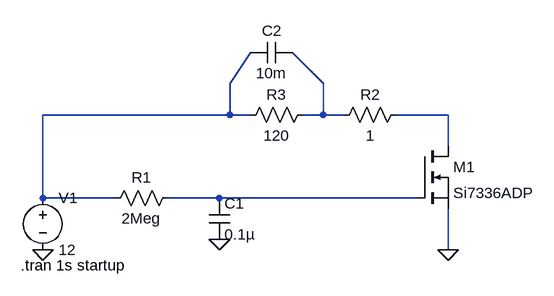
[diagram p0: schematic Prechrge.asc]
Prechrge.asc, the LTspice schematic file:
Version 4
SHEET 1 880 680
WIRE 240 -192 272 -240
WIRE 384 -192 336 -240
WIRE 240 -144 240 -192
WIRE 240 -144 -48 -144
WIRE 272 -144 240 -144
WIRE 384 -144 384 -192
WIRE 384 -144 352 -144
WIRE 416 -144 384 -144
WIRE 576 -144 496 -144
WIRE 576 -96 576 -144
WIRE -48 -16 -48 -144
WIRE 64 -16 -48 -16
WIRE 224 -16 144 -16
WIRE 528 -16 224 -16
WIRE 576 64 576 0
FLAG 224 48 0
FLAG -48 64 0
FLAG 576 64 0
SYMBOL res 160 -32 R90
WINDOW 0 0 56 VBottom 2
WINDOW 3 32 56 VTop 2
SYMATTR InstName R1
SYMATTR Value 2Meg
SYMBOL cap 208 -16 R0
SYMATTR InstName C1
SYMATTR Value 0.1µ
SYMATTR SpiceLine V=16
SYMBOL voltage -48 -32 R0
WINDOW 123 0 0 Left 0
WINDOW 39 0 0 Left 0
SYMATTR InstName V1
SYMATTR Value 12
SYMBOL nmos 528 -96 R0
SYMATTR InstName M1
SYMATTR Value Si7336ADP
SYMBOL res 512 -160 R90
WINDOW 0 0 56 VBottom 2
WINDOW 3 32 56 VTop 2
SYMATTR InstName R2
SYMATTR Value 1
SYMBOL cap 336 -256 R90
WINDOW 0 -2 31 VBottom 2
WINDOW 3 32 32 VTop 2
SYMATTR InstName C2
SYMATTR Value 10m
SYMBOL res 368 -160 R90
WINDOW 0 0 56 VBottom 2
WINDOW 3 32 56 VTop 2
SYMATTR InstName R3
SYMATTR Value 120
TEXT -82 88 Left 2 !.tran 1s startup

The netlist it stands for:
* Prechrge.asc
R1 N004 N001 2Meg
C1 N004 0 0.1µ V=16
V1 N001 0 12
M1 N003 N004 0 0 Si7336ADP
R2 N003 N002 1
C2 N002 N001 10m
R3 N002 N001 120
.model NMOS NMOS
.model PMOS PMOS
.lib standard.mos
.tran 1s startup
.backanno
.end